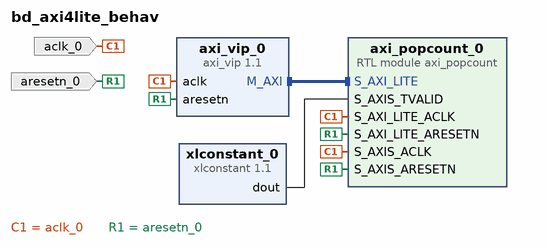
[diagram p0: block diagram of the top level]
# Vivado block design bd_axi4lite_behav, xc7z020clg400-1, Vivado 2020.2
create_bd_design bd_axi4lite_behav

create_bd_port -dir I -type clk aclk_0
create_bd_port -dir I -type rst aresetn_0

create_bd_cell -type ip -vlnv xilinx.com:ip:axi_vip:1.1 axi_vip_0
set_property -dict [list \
  CONFIG.ADDR_WIDTH 32 \
  CONFIG.DATA_WIDTH 32 \
  CONFIG.HAS_BRESP 1 \
  CONFIG.HAS_PROT 1 \
  CONFIG.HAS_RRESP 1 \
  CONFIG.HAS_WSTRB 1 \
  CONFIG.INTERFACE_MODE MASTER \
  CONFIG.PROTOCOL AXI4LITE \
  CONFIG.READ_WRITE_MODE READ_WRITE \
] [get_bd_cells axi_vip_0]
create_bd_cell -type module -reference axi_popcount axi_popcount_0
create_bd_cell -type ip -vlnv xilinx.com:ip:xlconstant:1.1 xlconstant_0
set_property -dict {CONFIG.CONST_VAL 0} [get_bd_cells xlconstant_0]

# ---- connections ----

connect_bd_intf_net [get_bd_intf_pins axi_vip_0/M_AXI] [get_bd_intf_pins axi_popcount_0/S_AXI_LITE]
connect_bd_net [get_bd_pins xlconstant_0/dout] [get_bd_pins axi_popcount_0/S_AXIS_TVALID]
connect_bd_net -net aclk_0_1 [get_bd_ports aclk_0] \
  [get_bd_pins axi_vip_0/aclk] [get_bd_pins axi_popcount_0/S_AXIS_ACLK] [get_bd_pins axi_popcount_0/S_AXI_LITE_ACLK]
connect_bd_net -net aresetn_0_1 [get_bd_ports aresetn_0] \
  [get_bd_pins axi_vip_0/aresetn] [get_bd_pins axi_popcount_0/S_AXIS_ARESETN] [get_bd_pins axi_popcount_0/S_AXI_LITE_ARESETN]

# ---- address map ----
assign_bd_address -offset 0x40000000 -range 4K -target_address_space [get_bd_addr_spaces axi_vip_0/Master_AXI] [get_bd_addr_segs axi_popcount_0/S_AXI_LITE/reg0]

validate_bd_design
save_bd_design
